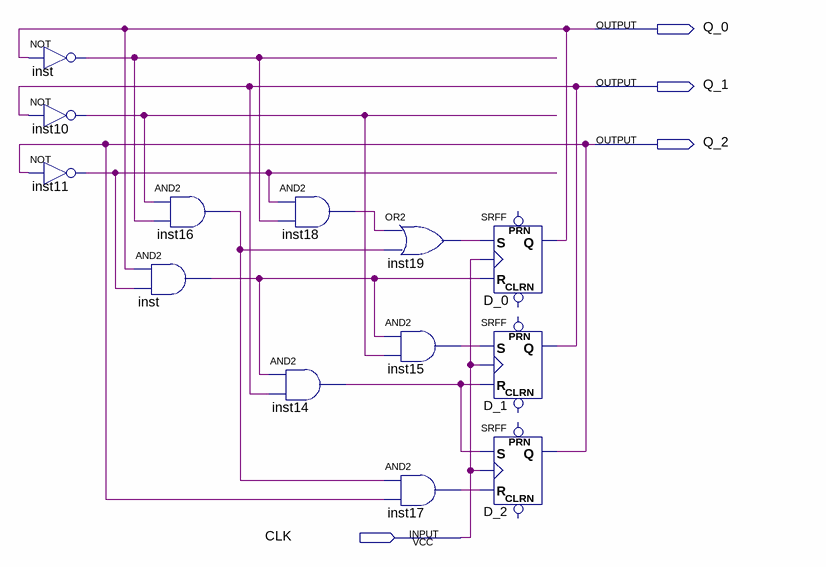
[diagram p0: schematic sheet]
// Quartus schematic hw11p3b.bdf as structural Verilog: 13 symbols, 4 pins
module hw11p3b (
  input  CLK,
  output Q_0,
  output Q_1,
  output Q_2
);

  wire inst10_out, inst11_out, inst14_out, inst15_out, inst16_out, inst17_out, inst18_out, inst19_out,
       inst_out, inst_out_2;

  not inst (inst_out, Q_0);
  not inst10 (inst10_out, Q_1);
  not inst11 (inst11_out, Q_2);
  and inst_dup2 (inst_out_2, Q_0, inst11_out);
  and inst16 (inst16_out, inst10_out, inst_out);
  and inst18 (inst18_out, inst11_out, inst_out);
  and inst14 (inst14_out, inst_out_2, Q_1);
  or inst19 (inst19_out, inst18_out, inst16_out);
  and inst15 (inst15_out, inst_out_2, inst10_out);
  and inst17 (inst17_out, inst16_out, Q_2);
  SRFF D_0 (.S(inst19_out), .R(inst_out_2), .CLK(CLK), .Q(Q_0));  // open: PRN, CLRN
  SRFF D_1 (.S(inst15_out), .R(inst14_out), .CLK(CLK), .Q(Q_1));  // open: PRN, CLRN
  SRFF D_2 (.S(inst14_out), .R(inst17_out), .CLK(CLK), .Q(Q_2));  // open: PRN, CLRN
endmodule
